# Altium schematic sheet type-c.SchDoc
size A4; SheetNumber: 3; SheetTotal: 6
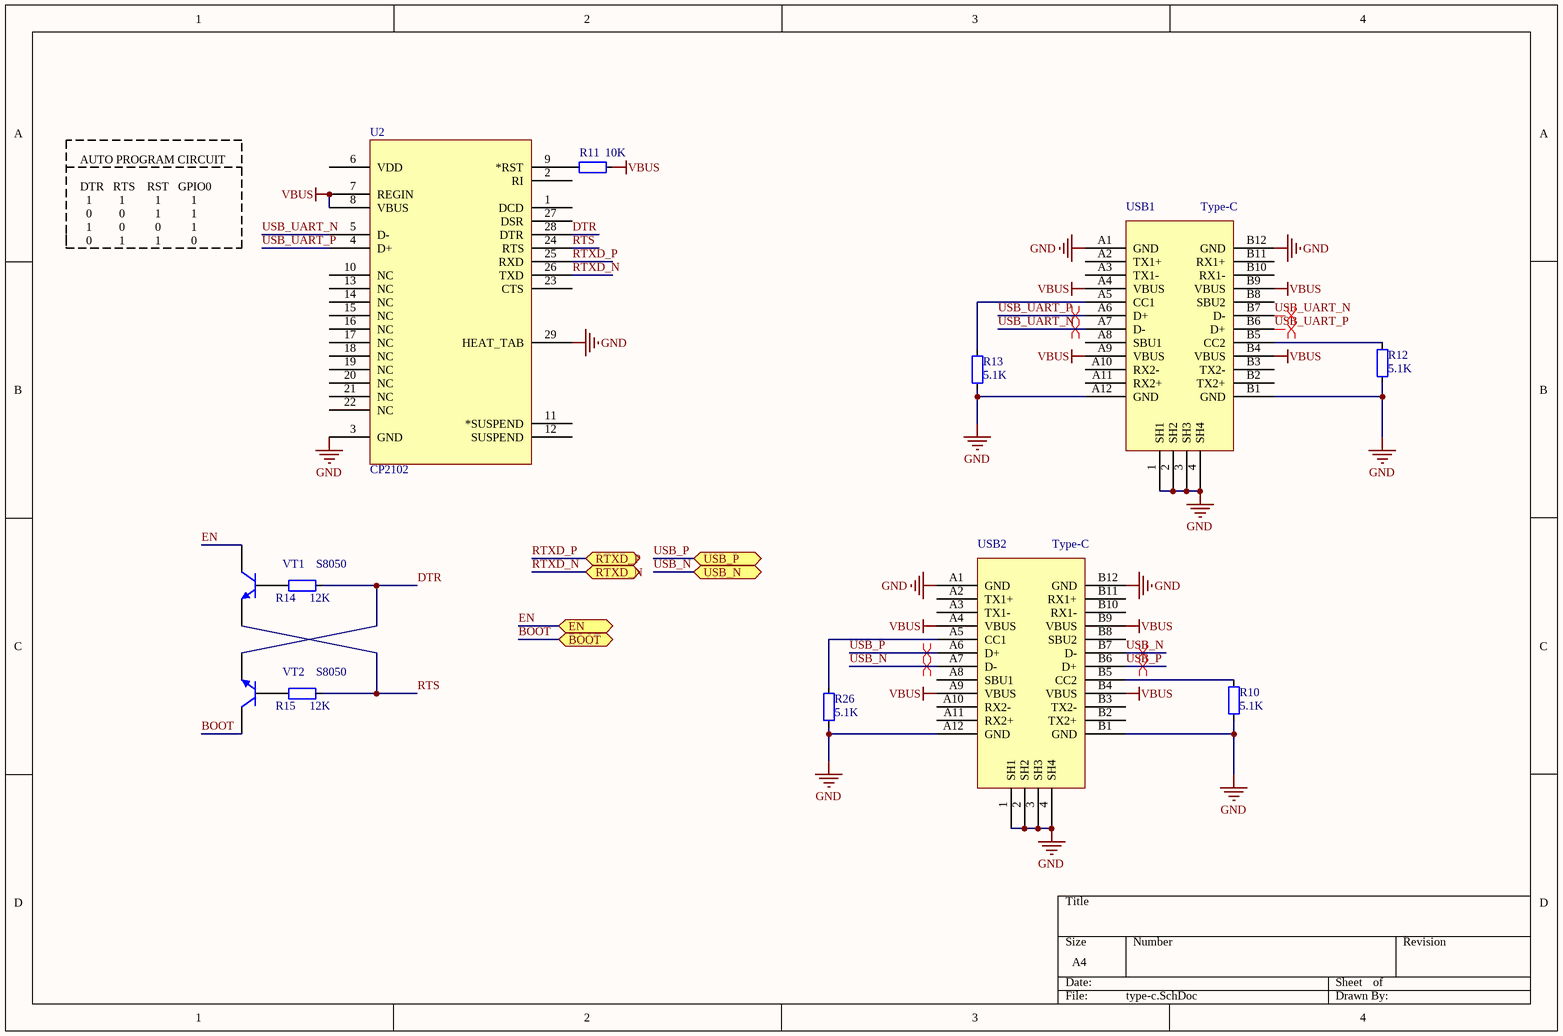
[diagram p0: type-c.SchDoc]

## Parts
R10  5.1K  [RES_0402]
R11  10K  [RES_0402]
R12  5.1K  [RES_0402]
R13  5.1K  [RES_0402]
R14  12K  [RES_0402]
R15  12K  [RES_0402]
R26  5.1K  [RES_0402]
U2  CP2102  [QFN-28]
USB1  Type-C  [Type-C-TOP]
USB2  Type-C  [Type-C-TOP]
VT1  S8050  [SMT_TRIODE_NPN]
VT2  S8050  [SMT_TRIODE_NPN]

## Ports
BOOT (bidir), EN (bidir), RTXD_N (bidir), RTXD_P (bidir), USB_N (bidir), USB_P (bidir)

## Nets
GND: R10.2 R12.2 R13.2 R26.2 U2.3(GND) U2.29(HEAT_TAB) USB1.1(SH1) USB1.2(SH2) USB1.3(SH3) USB1.4(SH4) USB1.A1(GND) USB1.A12(GND) USB1.B1(GND) USB1.B12(GND) USB2.1(SH1) USB2.2(SH2) USB2.3(SH3) USB2.4(SH4) USB2.A1(GND) USB2.A12(GND) USB2.B1(GND) USB2.B12(GND)
VBUS: R11.1 U2.7(REGIN) U2.8(VBUS) USB1.A4(VBUS) USB1.A9(VBUS) USB1.B4(VBUS) USB1.B9(VBUS) USB2.A4(VBUS) USB2.A9(VBUS) USB2.B4(VBUS) USB2.B9(VBUS)
BOOT: VT2.3(C) ; port BOOT
DTR: R14.1 U2.28(DTR) VT2.2(E)
EN: VT1.3(C) ; port EN
RTS: R15.1 U2.24(RTS) VT1.2(E)
RTXD_N: U2.26(TXD) ; port RTXD_N
RTXD_P: U2.25(RXD) ; port RTXD_P
USB_N: USB2.A7(D-) USB2.B7(D-) ; port USB_N
USB_P: USB2.A6(D+) USB2.B6(D+) ; port USB_P
USB_UART_N: U2.5(D-) USB1.A7(D-) USB1.B7(D-)
USB_UART_P: U2.4(D+) USB1.A6(D+) USB1.B6(D+)
NetR10_1: R10.1 USB2.B5(CC2)
NetR11_2: R11.2 U2.9(*RST)
NetR12_1: R12.1 USB1.B5(CC2)
NetR13_1: R13.1 USB1.A5(CC1)
NetR14_2: R14.2 VT1.1(B)
NetR15_2: R15.2 VT2.1(B)
NetR26_1: R26.1 USB2.A5(CC1)

Not connected (* = marked no-connect by the designer): U2 1(DCD) 2(RI) 6(VDD) 10(NC) 11(*SUSPEND) 12(SUSPEND) 13(NC) 14(NC) 15(NC) 16(NC) 17(NC) 18(NC) 19(NC) 20(NC) 21(NC) 22(NC) 23(CTS) 27(DSR); USB1 A2(TX1+) A3(TX1-) A8(SBU1) A10(RX2-) A11(RX2+) B2(TX2+) B3(TX2-) B8(SBU2) B10(RX1-) B11(RX1+); USB2 A2(TX1+) A3(TX1-) A8(SBU1) A10(RX2-) A11(RX2+) B2(TX2+) B3(TX2-) B8(SBU2) B10(RX1-) B11(RX1+)

## Layout directives
differential pair: USB_N, USB_P, USB_UART_N, USB_UART_P

## Notes on the sheet
- AUTO PROGRAM CIRCUIT
  DTR   RTS    RST   GPIO0
  1         1          1          1
  0         0          1          1
  1         0          0          1
  0         1          1          0

## Library data of the parts
R10-R15 R26 = 电阻-0402: Resistor; Value: 22R
U2 = CP2102: USB转TTL; PART DESC: SINGLE-CHIP USB TO UART BRIDGE, QFN28, RoHS.; MFG #1: SILICON LABS; PART NUMBER: CP2102; Value: Value; RefDes: RefDes; Type: DEV
USB1 USB2 = USB-Type-C-TOP
VT1 VT2 = SMT_TRIODE_NPN: Surface mount NPN transistor, package SOT-23